# Altium schematic sheet Sheet1.SchDoc
size A4; SheetNumber: 1; SheetTotal: 1
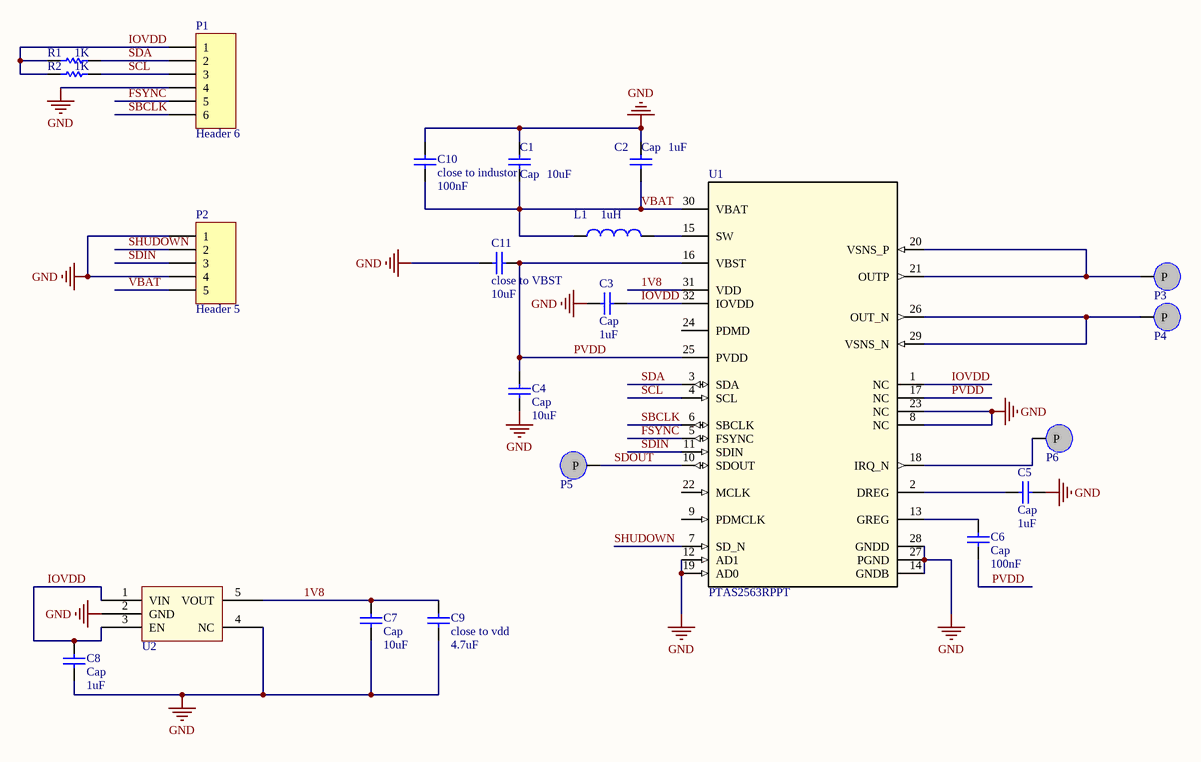
[diagram p0: Sheet1.SchDoc]

## Parts
C1  Cap  value 10uF  [6-0805_L]
C2  Cap  value 1uF  [6-0805_L]
C3  Cap  value 1uF  [6-0805_L]
C4  Cap  value 10uF  [6-0805_L]
C5  Cap  value 1uF  [6-0805_L]
C6  Cap  value 100nF  [1608[0603]]
C7  Cap  value 10uF  [6-0805_L]
C8  Cap  value 1uF  [6-0805_L]
C9  close to vdd  value 4.7uF  [6-0805_L]
C10  close to industor  value 100nF  [0402]
C11  close to VBST  value 10uF  [6-0805_L]
L1  value 1uH  [4040X20L]  (hidden comment: Inductor)
P1  Header 6  [DIP6-HOLE]
P2  Header 5  [DIP5-HOLE]
P3  Point  [Point]  (value not drawn)
P4  Point  [Point]  (value not drawn)
P5  Point  [Point-min]  (value not drawn)
P6  Point  [Point-min]  (value not drawn)
R1  value 1K  [0402]  (hidden comment: Res1)
R2  value 1K  [0402]  (hidden comment: Res1)
U1  PTAS2563RPPT  [RPP0032B-MFG]
U2  TPS70918  [SOT23-5]  (value not drawn)

## Nets
GND: C1.1 C2.2 C3.2 C4.1 C5.1 C7.1 C8.1 C9.1 C10.2 C11.2 P1.4 P2.1 P2.4 U1.8(NC) U1.12(AD1) U1.14(GNDB) U1.19(AD0) U1.23(NC) U1.27(PGND) U1.28(GNDD) U2.2(GND) U2.4(NC)
1V8: C7.2 C9.2 U1.31(VDD) U2.5(VOUT)
FSYNC: P1.5 U1.5(FSYNC)
IOVDD: C3.1 C8.2 P1.1 R1.1 R2.1 U1.1(NC) U1.32(IOVDD) U2.1(VIN) U2.3(EN)
PVDD: C4.2 C6.2 C11.1 U1.16(VBST) U1.17(NC) U1.25(PVDD)
SBCLK: P1.6 U1.6(SBCLK)
SCL: P1.3 R2.2 U1.4(SCL)
SDA: P1.2 R1.2 U1.3(SDA)
SDIN: P2.3 U1.11(SDIN)
SDOUT: P5.1(P) U1.10(SDOUT)
SHUDOWN: P2.2 U1.7(SD_N)
VBAT: C1.2 C2.1 C10.1 L1.1 P2.5 U1.30(VBAT)
NetC5_2: C5.2 U1.2(DREG)
NetC6_1: C6.1 U1.13(GREG)
NetL1_2: L1.2 U1.15(SW)
NetP3_1: P3.1(P) U1.20(VSNS_P) U1.21(OUTP)
NetP4_1: P4.1(P) U1.26(OUT_N) U1.29(VSNS_N)
NetP6_1: P6.1(P) U1.18(IRQ_N)

Not connected (* = marked no-connect by the designer): U1 9(PDMCLK) 22(MCLK) 24(PDMD)

## Library data of the parts
C1-C11 = Cap: Capacitor; Published: 8-Jun-2000; LatestRevisionDate: 17-Jul-2002; LatestRevisionNote: Re-released for DXP Platform.; PackageReference: RAD-0.3; Publisher: Altium Limited; PackageDescription: Radial Cap, Thru-Hole; 2 Leads; 0.3 in Pin Spacing
L1 = Inductor: Code_IEC: 1005; Published: 8-Jun-2000; LatestRevisionDate: 29-May-2009; LatestRevisionNote: IPC-7351 Footprint Added.; PackageReference: 0402-A; Publisher: Altium Limited; PackageDescription: Chip Inductor; Code_JEITA: 0402
P1 = Header 6: Header, 6-Pin; LatestRevisionDate: 17-Jul-2002; LatestRevisionNote: Re-released for DXP Platform.; Publisher: Altium Limited
P2 = Header 5: Header, 5-Pin; LatestRevisionDate: 17-Jul-2002; LatestRevisionNote: Re-released for DXP Platform.; Publisher: Altium Limited
R1 R2 = Res1: Resistor; Published: 8-Jun-2000; LatestRevisionDate: 17-Jul-2002; LatestRevisionNote: Re-released for DXP Platform.; PackageReference: AXIAL-0.3; Publisher: Altium Limited; PackageDescription: Axial Device, Thru-Hole; 2 Leads; 0.3 in Pin Spacing
U1 = PTAS2563RPPT: No Description Available; Mfr_Name: Texas Instruments; Type: DEV; RefDes: RefDes; Copyright: Copyright (C) 2023 Ultra Librarian. All rights reserved.; Manufacturer_Part_Number: PTAS2563RPPT